# Altium schematic sheet FLEX_OUTPUTS.SchDoc
size A3
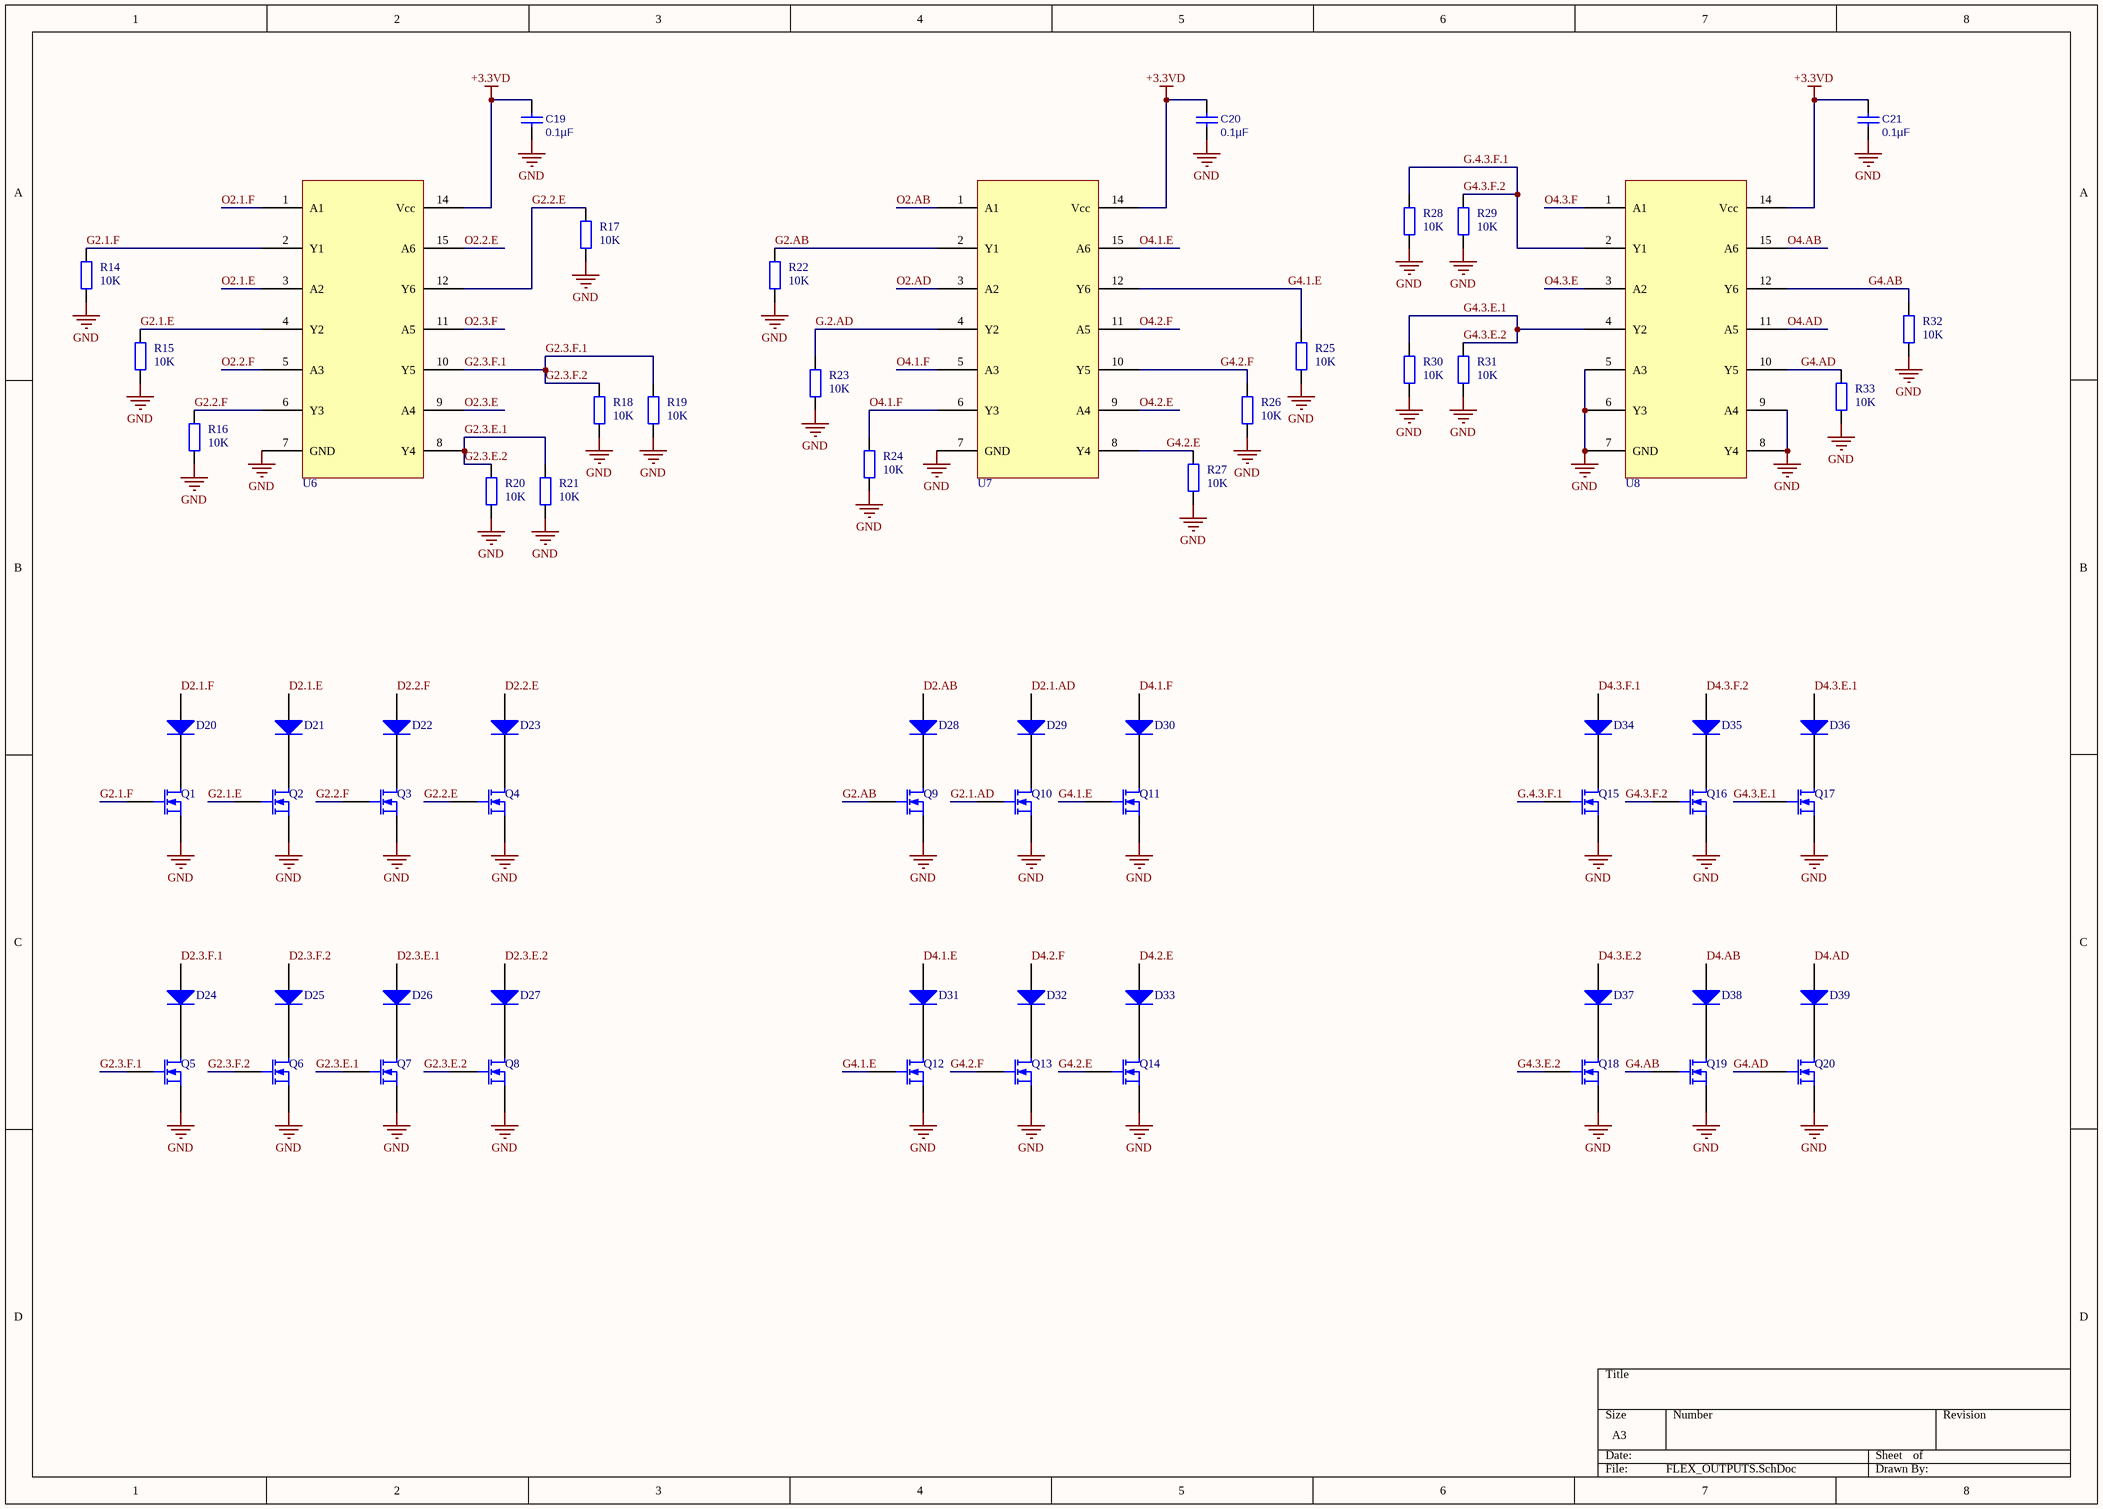
[diagram p0: FLEX_OUTPUTS.SchDoc]

## Parts
C19  value 0.1µF  [TDK C-Series (1608)]  (hidden comment: Cap)
C20  value 0.1µF  [TDK C-Series (1608)]  (hidden comment: Cap)
C21  value 0.1µF  [TDK C-Series (1608)]  (hidden comment: Cap)
D20  de  [Diode_Shottky]  (value not drawn)
D21  de  [Diode_Shottky]  (value not drawn)
D22  de  [Diode_Shottky]  (value not drawn)
D23  de  [Diode_Shottky]  (value not drawn)
D24  de  [Diode_Shottky]  (value not drawn)
D25  de  [Diode_Shottky]  (value not drawn)
D26  de  [Diode_Shottky]  (value not drawn)
D27  de  [Diode_Shottky]  (value not drawn)
D28  de  [Diode_Shottky]  (value not drawn)
D29  de  [Diode_Shottky]  (value not drawn)
D30  de  [Diode_Shottky]  (value not drawn)
D31  de  [Diode_Shottky]  (value not drawn)
D32  de  [Diode_Shottky]  (value not drawn)
D33  de  [Diode_Shottky]  (value not drawn)
D34  de  [Diode_Shottky]  (value not drawn)
D35  de  [Diode_Shottky]  (value not drawn)
D36  de  [Diode_Shottky]  (value not drawn)
D37  de  [Diode_Shottky]  (value not drawn)
D38  de  [Diode_Shottky]  (value not drawn)
D39  de  [Diode_Shottky]  (value not drawn)
Q1  (no value)  [MOSFET]
Q2  (no value)  [MOSFET]
Q3  (no value)  [MOSFET]
Q4  (no value)  [MOSFET]
Q5  (no value)  [MOSFET]
Q6  (no value)  [MOSFET]
Q7  (no value)  [MOSFET]
Q8  (no value)  [MOSFET]
Q9  (no value)  [MOSFET]
Q10  (no value)  [MOSFET]
Q11  (no value)  [MOSFET]
Q12  (no value)  [MOSFET]
Q13  (no value)  [MOSFET]
Q14  (no value)  [MOSFET]
Q15  (no value)  [MOSFET]
Q16  (no value)  [MOSFET]
Q17  (no value)  [MOSFET]
Q18  (no value)  [MOSFET]
Q19  (no value)  [MOSFET]
Q20  (no value)  [MOSFET]
R14  value 10K  [Panasonic ERJ-Series (1608)]
R15  value 10K  [Panasonic ERJ-Series (1608)]
R16  value 10K  [Panasonic ERJ-Series (1608)]
R17  value 10K  [Panasonic ERJ-Series (1608)]
R18  value 10K  [Panasonic ERJ-Series (1608)]
R19  value 10K  [Panasonic ERJ-Series (1608)]
R20  value 10K  [Panasonic ERJ-Series (1608)]
R21  value 10K  [Panasonic ERJ-Series (1608)]
R22  value 10K  [Panasonic ERJ-Series (1608)]
R23  value 10K  [Panasonic ERJ-Series (1608)]
R24  value 10K  [Panasonic ERJ-Series (1608)]
R25  value 10K  [Panasonic ERJ-Series (1608)]
R26  value 10K  [Panasonic ERJ-Series (1608)]
R27  value 10K  [Panasonic ERJ-Series (1608)]
R28  value 10K  [Panasonic ERJ-Series (1608)]
R29  value 10K  [Panasonic ERJ-Series (1608)]
R30  value 10K  [Panasonic ERJ-Series (1608)]
R31  value 10K  [Panasonic ERJ-Series (1608)]
R32  value 10K  [Panasonic ERJ-Series (1608)]
R33  value 10K  [Panasonic ERJ-Series (1608)]
U6  MC74VHCT50A  (value not drawn)
U7  MC74VHCT50A  (value not drawn)
U8  MC74VHCT50A  (value not drawn)

## Nets
+3.3VD: C19.2 C20.2 C21.2 U6.14(Vcc) U7.14(Vcc) U8.14(Vcc)
GND: C19.1 C20.1 C21.1 Q1.3(S) Q2.3(S) Q3.3(S) Q4.3(S) Q5.3(S) Q6.3(S) Q7.3(S) Q8.3(S) Q9.3(S) Q10.3(S) Q11.3(S) Q12.3(S) Q13.3(S) Q14.3(S) Q15.3(S) Q16.3(S) Q17.3(S) Q18.3(S) Q19.3(S) Q20.3(S) R14.1 R15.1 R16.1 R17.1 R18.1 R19.1 R20.1 R21.1 R22.1 R23.1 R24.1 R25.1 R26.1 R27.1 R28.1 R29.1 R30.1 R31.1 R32.1 R33.1 U6.7(GND) U7.7(GND) U8.5(A3) U8.6(Y3) U8.7(GND) U8.8(Y4) U8.9(A4)
D2.1.AD: D29.1(A)
D2.1.E: D21.1(A)
D2.1.F: D20.1(A)
D2.2.E: D23.1(A)
D2.2.F: D22.1(A)
D2.3.E.1: D26.1(A)
D2.3.E.2: D27.1(A)
D2.3.F.1: D24.1(A)
D2.3.F.2: D25.1(A)
D2.AB: D28.1(A)
D4.1.E: D31.1(A)
D4.1.F: D30.1(A)
D4.2.E: D33.1(A)
D4.2.F: D32.1(A)
D4.3.E.1: D36.1(A)
D4.3.E.2: D37.1(A)
D4.3.F.1: D34.1(A)
D4.3.F.2: D35.1(A)
D4.AB: D38.1(A)
D4.AD: D39.1(A)
G2.1.AD: Q10.2(G)
G2.1.E: Q2.2(G) R15.2 U6.4(Y2)
G2.1.F: Q1.2(G) R14.2 U6.2(Y1)
G2.2.E: Q4.2(G) R17.2 U6.12(Y6)
G2.2.F: Q3.2(G) R16.2 U6.6(Y3)
G2.3.E.1: Q7.2(G) Q8.2(G) R20.2 R21.2 U6.8(Y4)  [also labelled G2.3.E.2]
G2.3.F.1: Q5.2(G) Q6.2(G) R18.2 R19.2 U6.10(Y5)  [also labelled G2.3.F.2]
G2.AB: Q9.2(G) R22.2 U7.2(Y1)
G4.1.E: Q11.2(G) Q12.2(G) R25.2 U7.12(Y6)
G4.2.E: Q14.2(G) R27.2 U7.8(Y4)
G4.2.F: Q13.2(G) R26.2 U7.10(Y5)
G4.3.E.1: Q17.2(G) Q18.2(G) R30.2 R31.2 U8.4(Y2)  [also labelled G4.3.E.2]
G4.AB: Q19.2(G) R32.2 U8.12(Y6)
G4.AD: Q20.2(G) R33.2 U8.10(Y5)
G.2.AD: R23.2 U7.4(Y2)
G.4.3.F.1: Q15.2(G) Q16.2(G) R28.2 R29.2 U8.2(Y1)  [also labelled G4.3.F.2]
O2.1.E: U6.3(A2)
O2.1.F: U6.1(A1)
O2.2.E: U6.15(A6)
O2.2.F: U6.5(A3)
O2.3.E: U6.9(A4)
O2.3.F: U6.11(A5)
O2.AB: U7.1(A1)
O2.AD: U7.3(A2)
O4.1.E: U7.15(A6)
O4.1.F: R24.2 U7.5(A3) U7.6(Y3)
O4.2.E: U7.9(A4)
O4.2.F: U7.11(A5)
O4.3.E: U8.3(A2)
O4.3.F: U8.1(A1)
O4.AB: U8.15(A6)
O4.AD: U8.11(A5)
NetD20_2: D20.2(K) Q1.1(D)
NetD21_2: D21.2(K) Q2.1(D)
NetD22_2: D22.2(K) Q3.1(D)
NetD23_2: D23.2(K) Q4.1(D)
NetD24_2: D24.2(K) Q5.1(D)
NetD25_2: D25.2(K) Q6.1(D)
NetD26_2: D26.2(K) Q7.1(D)
NetD27_2: D27.2(K) Q8.1(D)
NetD28_2: D28.2(K) Q9.1(D)
NetD29_2: D29.2(K) Q10.1(D)
NetD30_2: D30.2(K) Q11.1(D)
NetD31_2: D31.2(K) Q12.1(D)
NetD32_2: D32.2(K) Q13.1(D)
NetD33_2: D33.2(K) Q14.1(D)
NetD34_2: D34.2(K) Q15.1(D)
NetD35_2: D35.2(K) Q16.1(D)
NetD36_2: D36.2(K) Q17.1(D)
NetD37_2: D37.2(K) Q18.1(D)
NetD38_2: D38.2(K) Q19.1(D)
NetD39_2: D39.2(K) Q20.1(D)

## Library data of the parts
C19-C21 = Cap: Capacitor; Published: 8-Jun-2000; LatestRevisionDate: 17-Jul-2002; LatestRevisionNote: Re-released for DXP Platform.; PackageReference: RAD-0.3; Publisher: Altium Limited; PackageDescription: Radial Cap, Thru-Hole; 2 Leads; 0.3 in Pin Spacing; Supplier 1: Digi-Key; Supplier Part Number 1: 445-5146-1-ND
D20-D39 = Diode: Default Diode; Published: 8-Jun-2000; LatestRevisionDate: 17-Jul-2002; LatestRevisionNote: Re-released for DXP Platform.; PackageVersion: Sep-1996; PackageReference: SMC; Publisher: Altium Limited; PackageDescription: DO-214-AB/SMC; 2 C-Bend Leads; Body 7.9 x 5.9 mm, inc. leads (LxW); Code_JEDEC: DO-214-AB; Supplier 1: Digi-Key; Supplier Part Number 1: 1727-5384-1-ND
Q1-Q20 = MOSFET-N: N-Channel MOSFET; Published: 8-Jun-2000; LatestRevisionDate: 17-Jul-2002; LatestRevisionNote: Re-released for DXP Platform.; PackageVersion: 1995/1996; PackageReference: E3; Publisher: Altium Limited; PackageDescription: TO, Flat Index; 3 In-Line, Axial Leads; Body Dia. 4.6mm; Lead Dia. 0.5 mm (max); Supplier 1: Digi-Key; Supplier 2: Digi-Key; Supplier Part Number 2: 497-7462-1-ND
R14-R33 = Res2: Resistor; Published: 8-Jun-2000; LatestRevisionDate: 17-Jul-2002; LatestRevisionNote: Re-released for DXP Platform.; PackageReference: AXIAL-0.4; Publisher: Altium Limited; PackageDescription: Axial Device, Thru-Hole; 2 Leads; 0.4 in Pin Spacing; Supplier 1: Digi-Key; Supplier 2: Digi-Key; Supplier Part Number 2: P10.0KHCT-ND
U6-U8 = MC74VHCT50A: 6-Channel CMOS Buffer